# EAGLE design top (EAGLE 9.3.0)
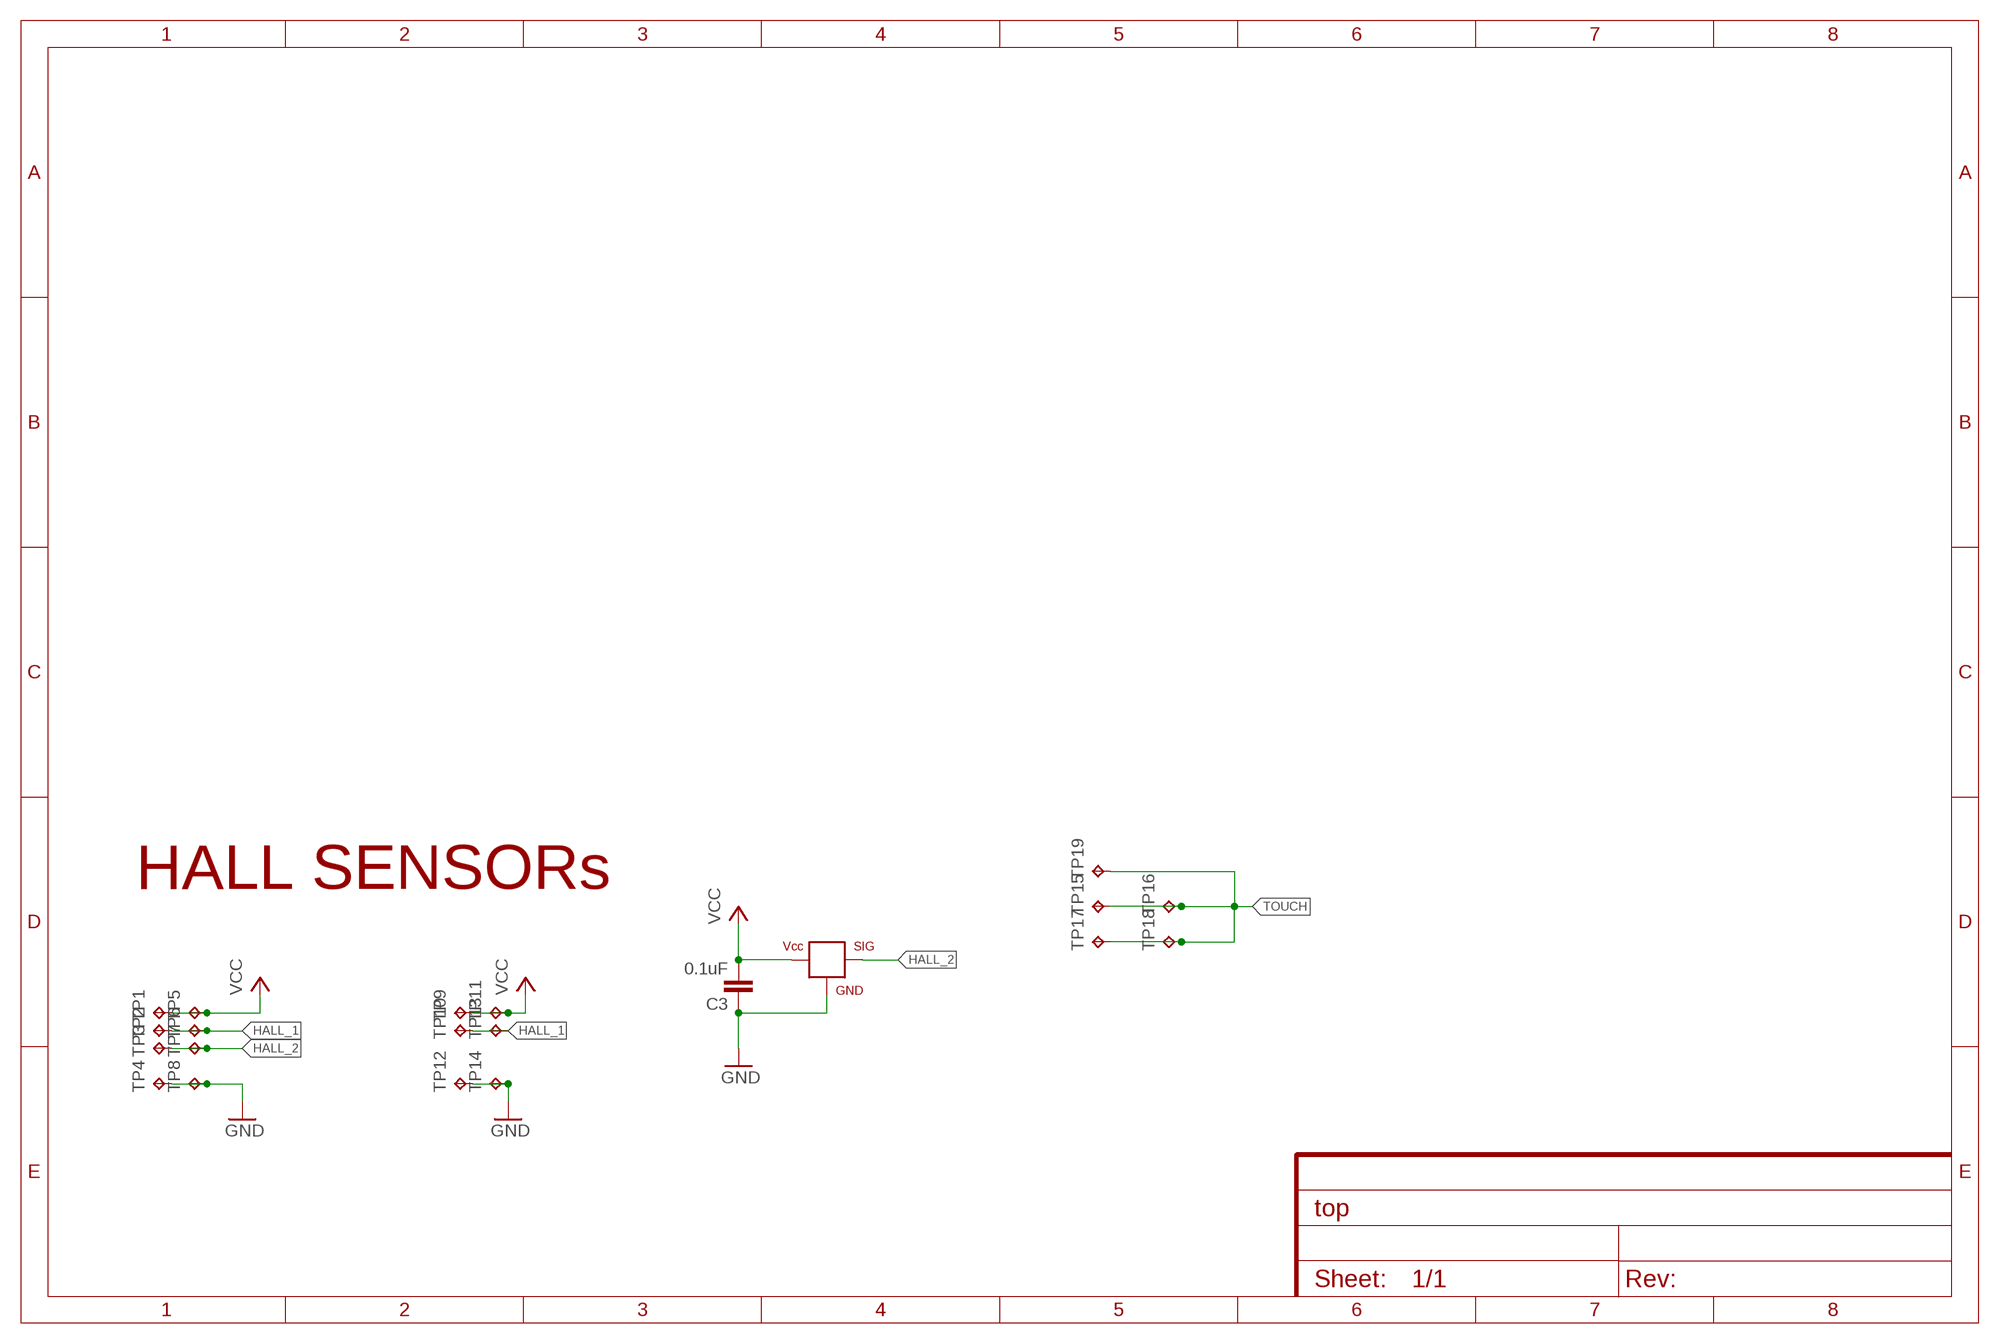
[diagram p0: schematic, sheet 1]

## Parts
C3  0.1uF  CAP0603-CAP  [0603-CAP]
HALL  HALLEFFECT-A1326  [SOT23-3]
TP1  TPTP10SQ  [TP10SQ]
TP2  TPTP10SQ  [TP10SQ]
TP3  TPTP10SQ  [TP10SQ]
TP4  TPTP10SQ  [TP10SQ]
TP5  TPTP10SQ  [TP10SQ]
TP6  TPTP10SQ  [TP10SQ]
TP7  TPTP10SQ  [TP10SQ]
TP8  TPTP10SQ  [TP10SQ]
TP9  TPTP10SQ  [TP10SQ]
TP10  TPTP10SQ  [TP10SQ]
TP11  TPTP10SQ  [TP10SQ]
TP12  TPTP10SQ  [TP10SQ]
TP13  TPTP10SQ  [TP10SQ]
TP14  TPTP10SQ  [TP10SQ]
TP15  TPTP10SQ  [TP10SQ]
TP16  TPTP10SQ  [TP10SQ]
TP17  TPTP10SQ  [TP10SQ]
TP18  TPTP10SQ  [TP10SQ]
TP19  TPTP10SQ  [TP10SQ]

## Nets
GND: C3.1 HALL.3(GND) TP4.TP TP8.TP TP12.TP TP14.TP
HALL_1: TP2.TP TP6.TP TP10.TP TP13.TP
HALL_2: HALL.2(SIG) TP3.TP TP7.TP
TOUCH: TP15.TP TP16.TP TP17.TP TP18.TP TP19.TP
VCC: C3.2 HALL.1(VCC) TP1.TP TP5.TP TP9.TP TP11.TP

## Notes on the sheet
- HALL SENSORs

## Library data of the parts
C3 = SparkFun:CAP: Capacitor Standard 0603 ceramic capacitor, and 0.1" leaded capacitor.
HALL = Andy_Sigler:HALLEFFECT-A1326
TP1-TP19 = testpad:TP: Test pad

## Board
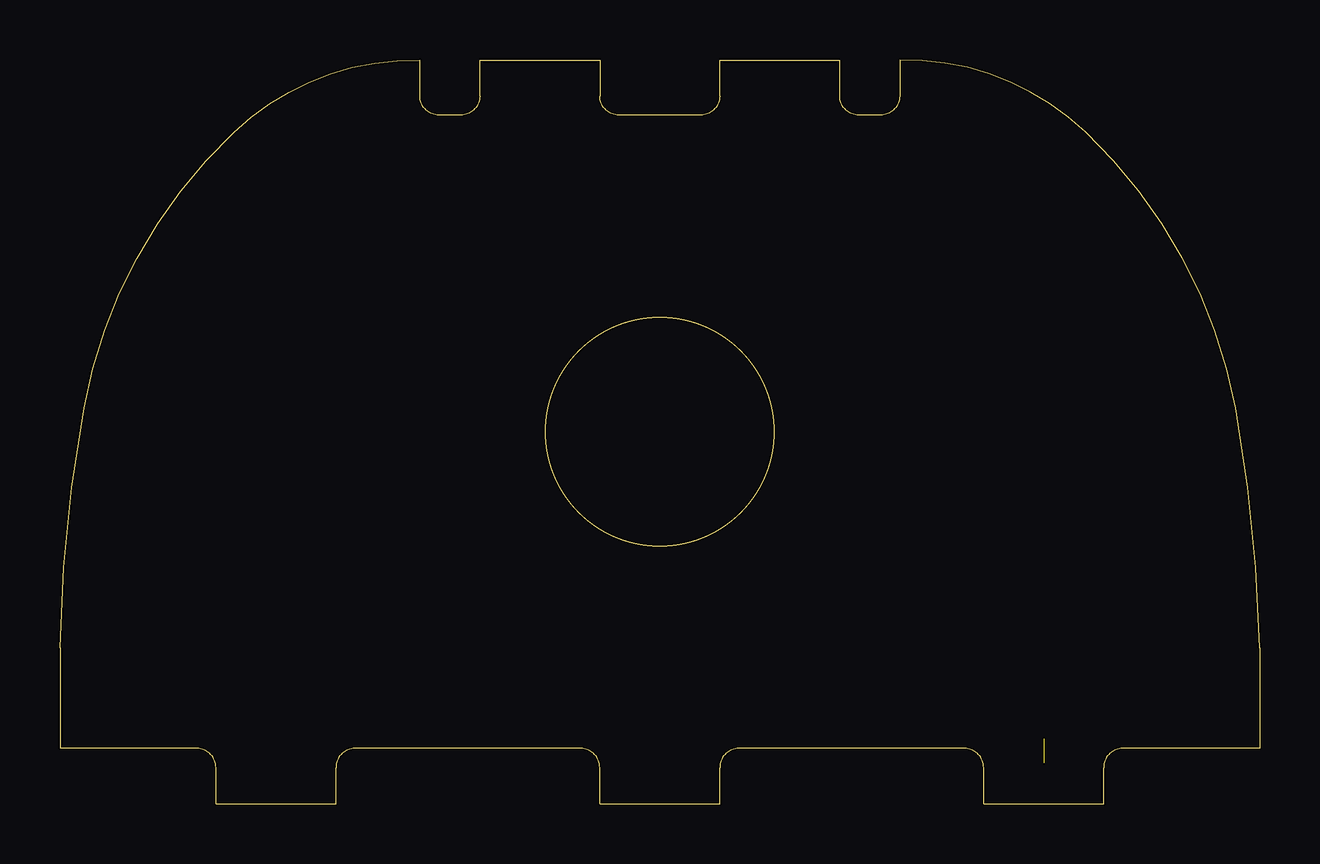
[diagram p1: board, top side]
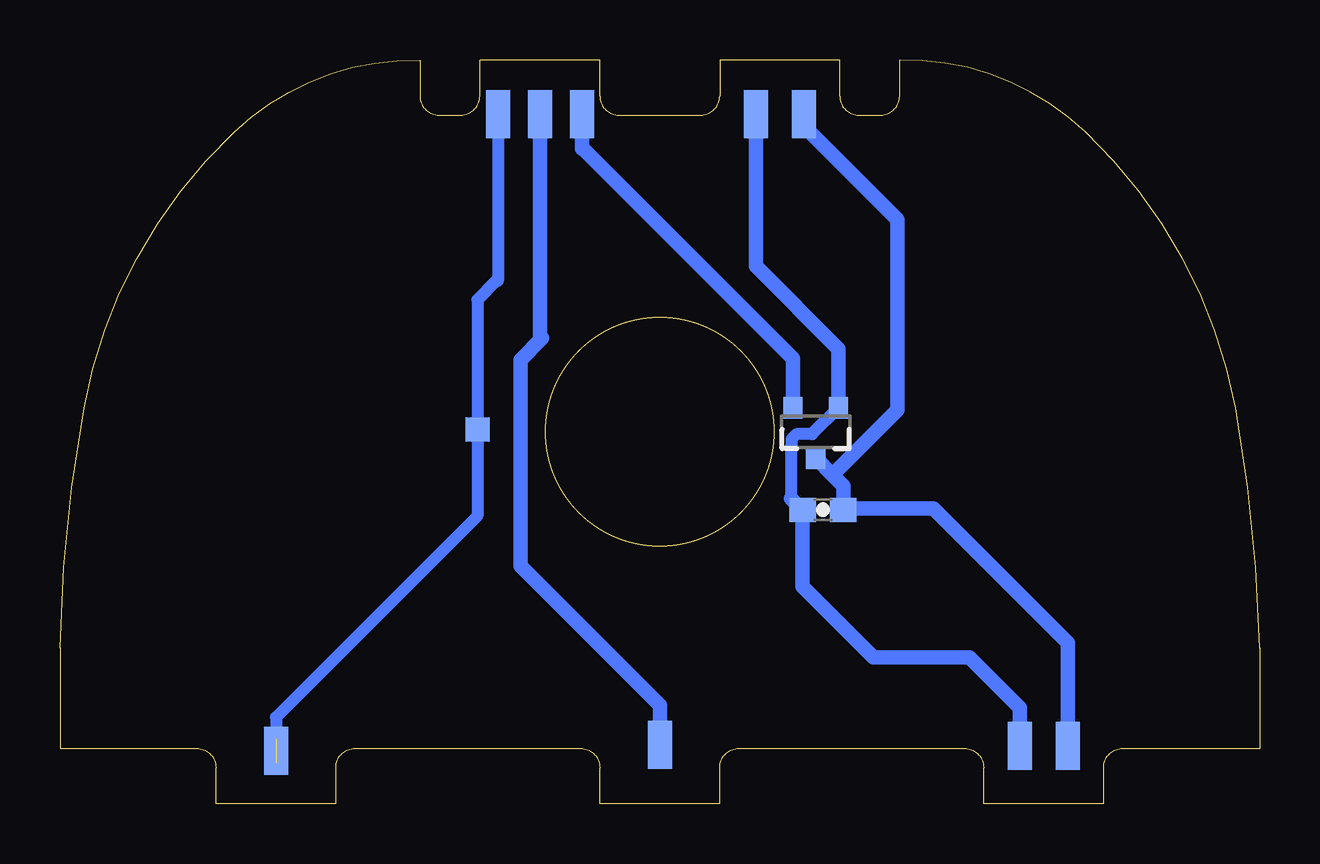
[diagram p2: board, bottom side, seen from below]

Size 50 x 31 mm. Coordinates in mm from the lower left corner, seen from the top.
Outline: 50,2.3 44.3,2.3 arc90 43.5,1.5 43.5,0 38.5,0 38.5,1.5 arc90 37.7,2.3 28.3,2.3 arc90 27.5,1.5 27.5,0 22.5,0 22.5,1.5 arc90 21.7,2.3 12.3,2.3 arc90 11.5,1.5 11.5,0 6.5,0 6.5,1.5 arc90 5.7,2.3 0,2.3 0,6.5 arc-10 1,16.5 arc-36 7.25,28 arc-45 15,31 15,29.5 arc90 15.8,28.7 16.7,28.7 arc90 17.5,29.5 17.5,31 22.5,31 22.5,29.5 arc90 23.3,28.7 26.7,28.7 arc90 27.5,29.5 27.5,31 32.5,31 32.5,29.5 arc90 33.3,28.7 34.2,28.7 arc90 35,29.5 35,31 arc-45 42.75,28 arc-36 49,16.5 arc-10 50,6.5 50,2.3
Outline: circle at 25,15.5 radius 4.76
Copper layers (1*16): Top 0.0356mm / dielectric 1.5011mm / Bottom 0.0356mm
Design rules "LaenPCBOrder *": minimum track width 6mil, minimum drill 13mil, track to track 6mil, track to pad 6mil, pad to pad 6mil, via to via 6mil, smd to smd 6mil, copper to edge 15mil, drill to drill 6mil, minimum pad ring 7mil, minimum via ring 7mil, stop-mask expansion 3mil, vias tented up to drill 20mil, thermal gap 10mil

### Footprints (pad centres in the part's own frame; a part is rotated, then mirrored left to right if it is on the bottom)
0603-CAP = smd 1.1 x 1: 1 -0.85,0; 2 0.85,0
SOT23-3 = smd 0.8 x 0.9: 1 -0.95,-1; 2 0.95,-1; 3 0,1.1
TP10SQ = smd 1 x 1: TP 0,0

### Placement (x,y rotation side)
C3  18.2,12.25 180 bottom
HALL  18.5,15.5 180 bottom
TP1  10,2.9 90 bottom
TP2  25,2.95 90 bottom
TP3  28.25,29.25 90 bottom
TP4  8,2.9 90 bottom
TP5  10,1.9 90 bottom
TP6  25,1.95 90 bottom
TP7  28.25,28.25 90 bottom
TP8  8,1.9 90 bottom
TP9  21,28.25 90 bottom
TP10  30,28.25 90 bottom
TP11  21,29.25 90 bottom
TP12  19,29.25 90 bottom
TP13  30,29.25 90 bottom
TP14  19,28.25 90 bottom
TP15  41,1.7 180 bottom
TP16  41,2.7 180 bottom
TP17  32.6,15.6 180 bottom
TP18  31.75,28.25 180 bottom
TP19  31.75,29.25 180 bottom

### Tracks (layer width: path | path; a pad name or v marks a point on that pad's centre or on a via)
GND
  Bottom 0.61: TP12.TP TP14.TP 15.1,24.35 15.1,16.4 17.8,13.7 | TP8.TP TP4.TP 8,6.7 13.6,12.3 17.3,12.3 C3.1 17.35,13.25 17.8,13.7 | HALL.3 17.8,13.7
HALL_1
  Bottom 0.61: TP13.TP TP10.TP 30,19.42 29.9,19.4 30.8,18.5 30.8,9.9 25,4.1 TP2.TP TP6.TP
HALL_2
  Bottom 0.61: TP3.TP TP7.TP 28.25,27.31 28.2,27.3 19.45,18.55 HALL.2
TOUCH  (1 unrouted)
  Bottom 0.508: TP19.TP TP18.TP 31.75,21.8 31.8,21.8 32.6,21 TP17.TP 32.6,12 41,3.6 TP16.TP
VCC
  Bottom 0.508: HALL.1 18.65,15.4 19.3,15.4 19.5,15.2 19.5,14.91 19.53,14.89 19.53,12.73
  Bottom 0.61: TP11.TP TP9.TP 21,22.4 17.55,18.95 HALL.1 | TP5.TP TP1.TP 10,4 12.1,6.1 16.1,6.1 19.05,9.05 C3.2 19.53,12.73